# EAGLE design ReflowMaster (EAGLE 7.1.0)
COMPANY: Unexpected Maker; COPYRIGHT: 2018; DATE: 2018; DRAWN: SEON; REV: F; TITLE: Time Timer Controller Board
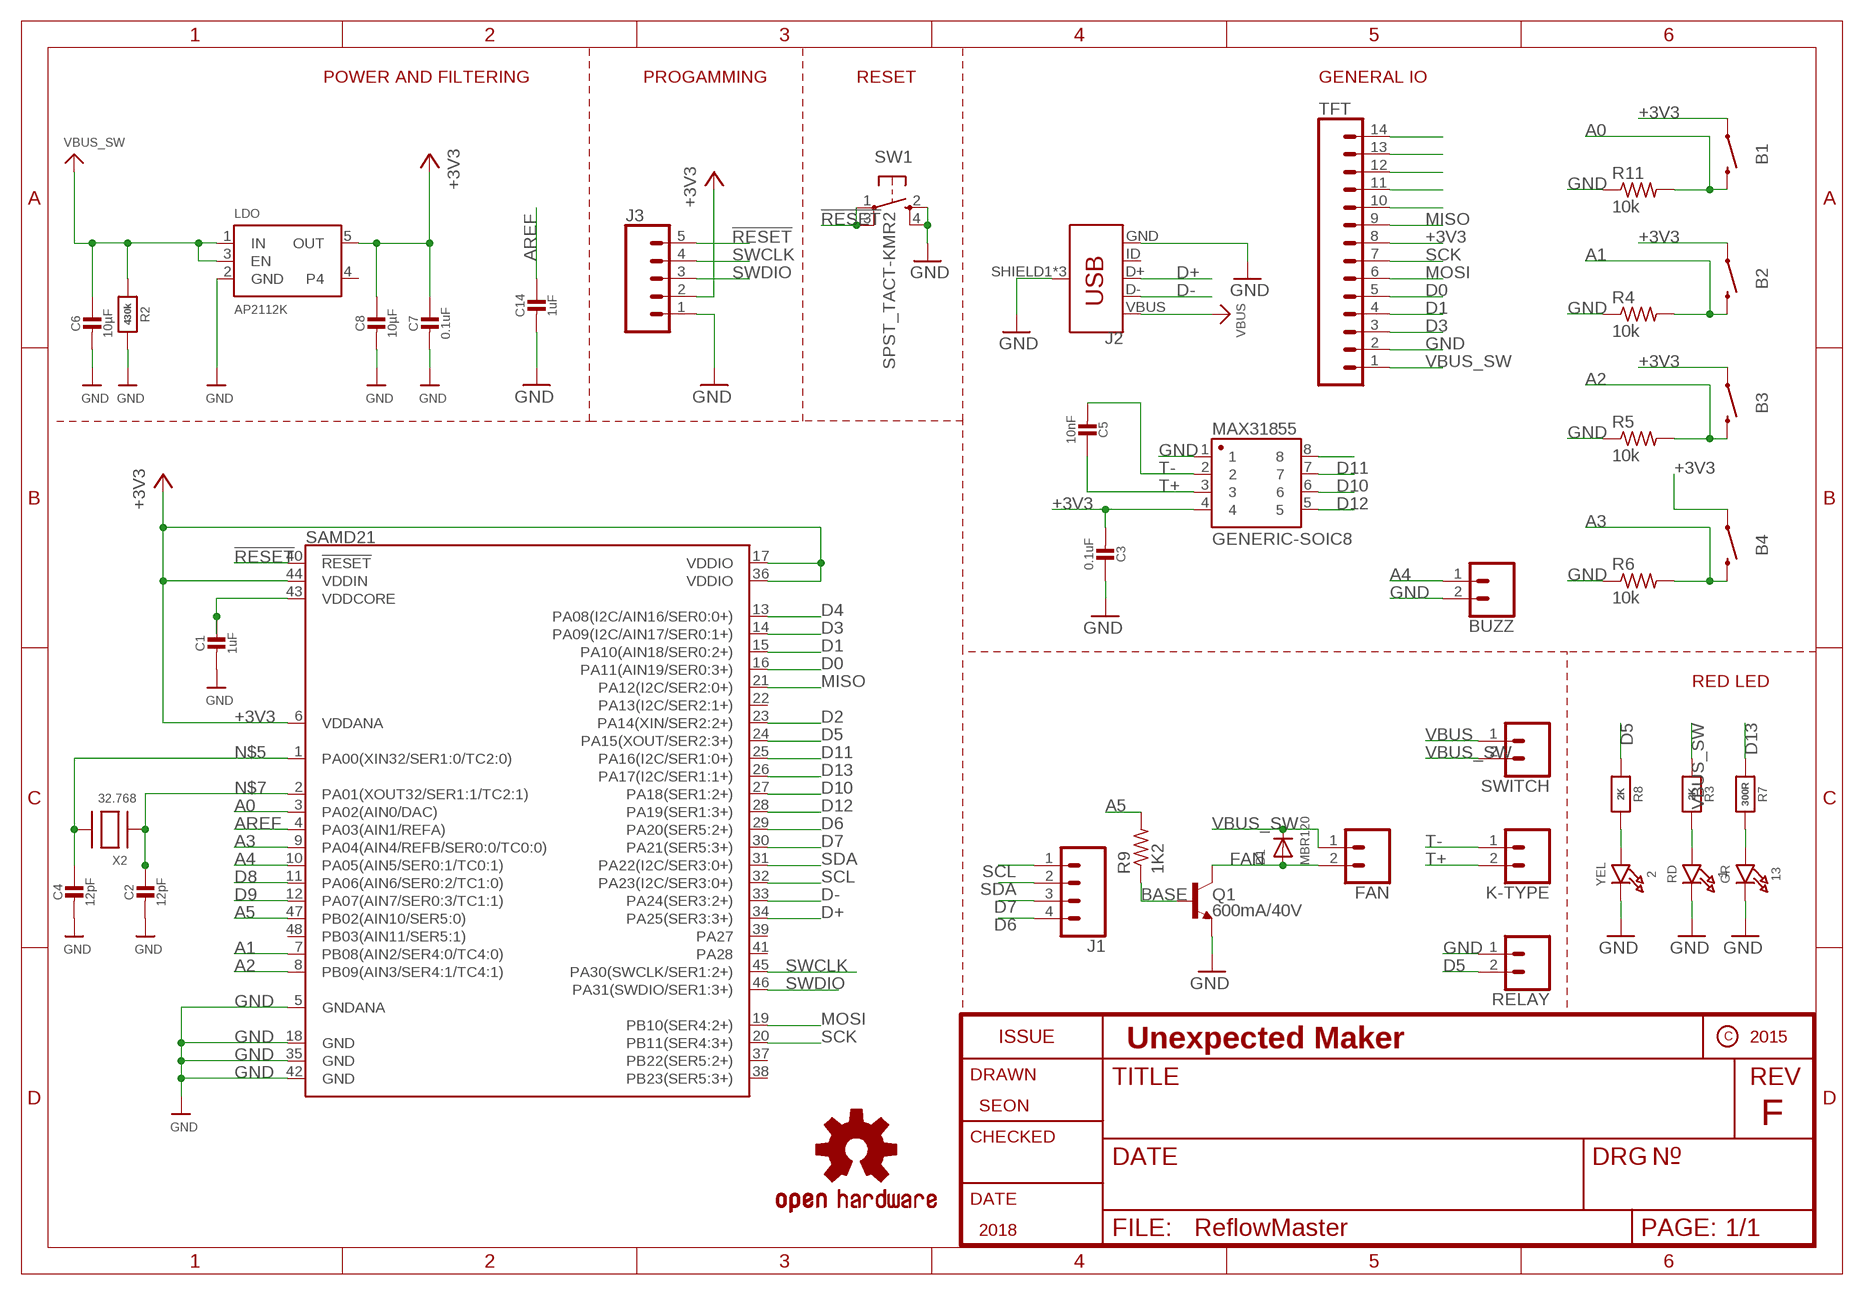
[diagram p0: schematic, sheet 1]

## Parts
1  RD  LED0805_NOOUTLINE  [CHIPLED_0805_NOOUTLINE]
2  YEL  LED0805_NOOUTLINE  [CHIPLED_0805_NOOUTLINE]
13  GR  LED0805_NOOUTLINE  [CHIPLED_0805_NOOUTLINE]
B1  MOMENTARY-SWITCH-SPST-PTH-RIGHT-ANGLE-KIT  [TACTILE_SWITCH_PTH_RIGHT_ANGLE_KIT]
B2  MOMENTARY-SWITCH-SPST-PTH-RIGHT-ANGLE-KIT  [TACTILE_SWITCH_PTH_RIGHT_ANGLE_KIT]
B3  MOMENTARY-SWITCH-SPST-PTH-RIGHT-ANGLE-KIT  [TACTILE_SWITCH_PTH_RIGHT_ANGLE_KIT]
B4  MOMENTARY-SWITCH-SPST-PTH-RIGHT-ANGLE-KIT  [TACTILE_SWITCH_PTH_RIGHT_ANGLE_KIT]
BUZZ  CONN_02  [1X02]
C1  1uF  CAP_CERAMIC0805-NOOUTLINE  [0805-NO]
C2  12pF  CAP_CERAMIC0805-NOOUTLINE  [0805-NO]
C3  0.1uF  CAP_CERAMIC0805-NOOUTLINE  [0805-NO]
C4  12pF  CAP_CERAMIC0805-NOOUTLINE  [0805-NO]
C5  10nF  CAP_CERAMIC0805-NOOUTLINE  [0805-NO]
C6  10µF  CAP_CERAMIC0805-NOOUTLINE  [0805-NO]
C7  0.1uF  CAP_CERAMIC0805-NOOUTLINE  [0805-NO]
C8  10µF  CAP_CERAMIC0805-NOOUTLINE  [0805-NO]
C14  1uF  CAP_CERAMIC0805-NOOUTLINE  [0805-NO]
D1  MBR120  DIODESOD-123  [SOD-123]
FAN  CONN_02  [1X02]
J1  CONN_041X04_NO_SILK  [1X04_NO_SILK]
J2  USB_MICRO-B_FEMALE-SMT  [USB-B-MICRO-SMD]
J3  CONN_05NO_SILK  [1X05_NO_SILK]
K-TYPE  CONN_02  [1X02]
LDO  AP2112K  VREG_SOT23-5  [SOT23-5]
LOGO1  OSHW-LOGOS  [OSHW-LOGO-S]
MAX31855  GENERIC-SOIC8  [SO08-UNIVERSAL]
Q1  600mA/40V  TRANS_NPN-MMBT2222AL  [SOT23-3]
R2  430k  RESISTOR0805_NOOUTLINE  [0805-NO]
R3  2K  RESISTOR0805_NOOUTLINE  [0805-NO]
R4  10k  R-US_R0805  [R0805]
R5  10k  R-US_R0805  [R0805]
R6  10k  R-US_R0805  [R0805]
R7  300R  RESISTOR0805_NOOUTLINE  [0805-NO]
R8  2K  RESISTOR0805_NOOUTLINE  [0805-NO]
R9  1K2  R-US_R0805  [R0805]
R11  10k  R-US_R0805  [R0805]
RELAY  CONN_02  [1X02]
SAMD21  ATSAMD21G-A  [TQFP-48]
SW1  SPST_TACT-KMR2  [KMR2]
SWITCH  CONN_02  [1X02]
TFT  CONN_14NO_SILK  [1X14_NO_SILK]
X2  32.768  XTAL-3.2X1.5  [XTAL3215]

## Nets
!RESET: J3.5 SAMD21.40(!RESET!) SW1.1(P) SW1.3(P1)
+3V3: B1.1 B2.1 B3.1 B4.1 C3.2 C7.1 C8.1 J3.2 LDO.5(OUT) MAX31855.4 SAMD21.6(VDDANA) SAMD21.17(VDDIO) SAMD21.36(VDDIO) SAMD21.44(VDDIN) TFT.8
A0: B1.2 R11.2 SAMD21.3(PA02(AIN0/DAC))
A1: B2.2 R4.2 SAMD21.7(PB08(AIN2/SER4:0/TC4:0))
A2: B3.2 R5.2 SAMD21.8(PB09(AIN3/SER4:1/TC4:1))
A3: B4.2 R6.2 SAMD21.9(PA04(AIN4/REFB/SER0:0/TC0:0))
A4: BUZZ.1 SAMD21.10(PA05(AIN5/SER0:1/TC0:1))
A5: R9.2 SAMD21.47(PB02(AIN10/SER5:0))
AREF: C14.1 SAMD21.4(PA03(AIN1/REFA))
BASE: Q1.1(B) R9.1
D0: SAMD21.16(PA11(AIN19/SER0:3+)) TFT.5
D1: SAMD21.15(PA10(AIN18/SER0:2+)) TFT.4
D2: SAMD21.23(PA14(XIN/SER2:2+))
D3: SAMD21.14(PA09(I2C/AIN17/SER0:1+)) TFT.3
D4: SAMD21.13(PA08(I2C/AIN16/SER0:0+))
D5: R8.1 RELAY.2 SAMD21.24(PA15(XOUT/SER2:3+))
D6: J1.4 SAMD21.29(PA20(SER5:2+))
D7: J1.3 SAMD21.30(PA21(SER5:3+))
D8: SAMD21.11(PA06(AIN6/SER0:2/TC1:0))
D9: SAMD21.12(PA07(AIN7/SER0:3/TC1:1))
D10: MAX31855.6 SAMD21.27(PA18(SER1:2+))
D11: MAX31855.7 SAMD21.25(PA16(I2C/SER1:0+))
D12: MAX31855.5 SAMD21.28(PA19(SER1:3+))
D13: R7.1 SAMD21.26(PA17(I2C/SER1:1+))
D+: J2.D+ SAMD21.34(PA25(SER3:3+))
D-: J2.D- SAMD21.33(PA24(SER3:2+))
FAN: D1.A FAN.2 Q1.3(C)
GND: 1.C 2.C 13.C BUZZ.2 C1.2 C2.2 C3.1 C4.2 C6.2 C7.2 C8.2 C14.2 J2.GND J2.SHIELD1(SHIELD) J2.SHIELD2(SHIELD) J2.SHIELD3(SHIELD) J3.1 LDO.2(GND) MAX31855.1 Q1.2(E) R2.2 R4.1 R5.1 R6.1 R11.1 RELAY.1 SAMD21.5(GNDANA) SAMD21.18(GND) SAMD21.35(GND) SAMD21.42(GND) SW1.2(S) SW1.4(S1) TFT.2
MISO: SAMD21.21(PA12(I2C/SER2:0+)) TFT.9
MOSI: SAMD21.19(PB10(SER4:2+)) TFT.6
N$1: 1.A R3.2
N$2: 13.A R7.2
N$3: 2.A R8.2
N$5: C4.1 SAMD21.1(PA00(XIN32/SER1:0/TC2:0)) X2.P$2
N$7: C2.1 SAMD21.2(PA01(XOUT32/SER1:1/TC2:1)) X2.P$1
N$8: MAX31855.8
N$11: TFT.10
N$12: TFT.11
N$13: TFT.12
N$14: TFT.13
N$15: TFT.14
SCK: SAMD21.20(PB11(SER4:3+)) TFT.7
SCL: J1.1 SAMD21.32(PA23(I2C/SER3:0+))
SDA: J1.2 SAMD21.31(PA22(I2C/SER3:0+))
SWCLK: J3.4 SAMD21.45(PA30(SWCLK/SER1:2+))
SWDIO: J3.3 SAMD21.46(PA31(SWDIO/SER1:3+))
T+: C5.1 K-TYPE.2 MAX31855.3
T-: C5.2 K-TYPE.1 MAX31855.2
VBUS: J2.VBUS SWITCH.1
VBUS_SW: C6.1 D1.C FAN.1 LDO.1(IN) LDO.3(EN) R2.1 R3.1 SWITCH.2 TFT.1
VDDCORE: C1.1 SAMD21.43(VDDCORE)
Unconnected: J2.ID LDO.4 SAMD21.22(PA13(I2C/SER2:1+)) SAMD21.37(PB22(SER5:2+)) SAMD21.38(PB23(SER5:3+)) SAMD21.39(PA27) SAMD21.41(PA28) SAMD21.48(PB03(AIN11/SER5:1))

## Notes on the sheet
- POWER AND FILTERING | PROGAMMING | RESET | GENERAL IO
- RED LED

## Library data of the parts
1 2 13 = microbuilder:LED: LED 0603 - 0603 Surface Mount Package 2mA: Green LED - Low Power (3.9mcd, 2ma, 1.7Vf) - Digikey: 475-2709-2-ND Orange LED - Low Power (9.8mcd, 2ma, 1.8Vf) - Digikey: 475-1194-2-ND Red LED - Low Power (5mcd, 2ma, 1.8Vf) - Digikey: 475-1195-2-ND Yellow LED - Low Power (7mcd, 2ma, 1.8Vf) - Digikey: 475-1196-2-ND 5mA: Blue LED - Low Power (17mcd, 5ma, 2.9Vf) - Digikey: LNJ937W8CRACT-ND 0805 - 0805 Surface Mount Package 2mA: Red LED (8.8mcd, 2mA, 1.8Vf, Clear) - Low Power [Digikey: 475-2510-1-ND] Green LED (5mcd, 2mA, 1.8Vf, Clear) - Low Power [Digikey: 475-2730-1-ND] Yellow LED (11.3mcd, 2mA, 1.8Vf, Clear) - Low Power [Digikey: 475-2555-1-ND] 20mA: Red LED (104mcd, 20mA, Diffused) - LS R976 [Digikey: 475-1278-6-ND] Red LED (12mcd, 20mA, 2.0Vf, Clear) - APT2012EC [Digikey: 754-1128-1-ND] Green LED (15mcd, 20mA, 2.2Vf, Clear) - APT2012GC [Digikey: 754-1131-1-ND] Orange LED (160mcd, 20mA, 2.1Vf, Clear) - APT2012SECK [Digikey: 754-1130-1-ND] 1206 - 1206 Surface Mount Package Green LED (26mcd, 20mA, Diffused) - LG N971 [Digikey: 475-1407-6-ND] Red LED (15mcd, 20mA, Diffused) - LH N974 [Digikey: 475-1416-6-ND] Cree - Cree High-Power Surface Mount LEDs XPEBWT-L1-0000-00D50 - White 111lm 350mA 2.9Vf 6200K 110° XTEAWT-00-0000-00000LEE3 - White 114lm 350mA 2.85Vf 5000K 115° Everlight - Everlight 45-21 Series Surface Mount LEDs 45-21/QK2C-B2832AC2CB2/2T - Warm White 2000mcd 20mA 3.25Vf 3050K 120° 45-21/LK2C-B38452C4CB2/2T - Nuetral White 2000mcd 20mA 3.25Vf 4150K 120° 45-21/LK2C-B50634C6CB2/2T - Cold White 2200mcd 20mA 3.25Vf 5650K 120° PLCC2 Reverse Mount LS T77K-J1L2-1-0-2-R18-Z - Red 11.25mcd 2mA 1.8Vf 630nm 120° LO T77K-L1M2-24-Z - Orange 19.6mcd 2mA 1.8Vf 606nm 120° LY T77K-K2M1-26-Z - Yellow 15.7mcd 2mA 1.8Vf 587nm 120°
B1-B4 = SparkFun-Switches:MOMENTARY-SWITCH-SPST: Momentary Switch (Pushbutton) - SPST Normally-open (NO) SPST momentary switches (buttons, pushbuttons). Variants PTH-12MM - 12mm square, through-hole Momentary Pushbutton Switch - 12mm Square <https://www.sparkfun.com/products/9190> (COM-09190) PTH-6.0MM, PTH-6.0MM-KIT - 6.0mm square, through-hole Mini Pushbutton Switch <https://www.sparkfun.com/products/97> (COM-00097) KIT package intended for soldering kit's - only one side of pads' copper is exposed. PTH-RIGHT-ANGLE-KIT - Right-angle, through-hole Right Angle Tactile Button <https://www.sparkfun.com/products/10791> - Used on SparkFun BigTime Watch Kit <https://www.sparkfun.com/products/11734> SMD-12MM - 12mm square, surface-mount Tactile Button - SMD (12mm) <https://www.sparkfun.com/products/12993> (COM-12993) Used on SparkFun PicoBoard <https://www.sparkfun.com/products/11888> SMD-4.5MM - 4.5mm Square Trackball Switch Used on SparkFun Blackberry Trackballer Breakout <https://www.sparkfun.com/products/13169> SMD-4.6MMX2.8MM - 4.60mm x 2.80mm, surface mount Used on SparkFun SAMD21 Mini Breakout <https://www.sparkfun.com/products/13664> SMD-5.2MM, SMD-5.2-REDUNDANT - 5.2mm square, surface-mount Mini Pushbutton Switch - SMD <https://www.sparkfun.com/products/8720> (COM-08720) Used on Arduino Pro Mini <https://www.sparkfun.com/products/11114> REDUNDANT package connects both switch circuits together SMD-6.0X3.5MM - 6.0 x 3.5mm, surface mount Momentary Reset Switch SMD <https://www.sparkfun.com/products/8229> (COM-08229) SMD-6.2MM-TALL - 6.2mm square, surface mount Tactile Button - SMD (6mm) <https://www.sparkfun.com/products/12992> Used on SparkFun Digital Sandbox <https://www.sparkfun.com/products/12651> SMD-RIGHT-ANGLE - Right-angle, surface mount Used on SparkFun Block for Intel® Edison - Arduino <https://www.sparkfun.com/products/13036>; PROD_ID: CONN-10672; SF_SKU: COM-10791
BUZZ FAN K-TYPE RELAY SWITCH = SparkFun-Connectors:CONN_02: Multi connection point. Often used as Generic Header-pin footprint for 0.1 inch spaced/style header connections On any of the 0.1 inch spaced packages, you can populate with these: Break Away Headers - Straight <https://www.sparkfun.com/products/116> (PRT-00116) Break Away Male Headers - Right Angle <https://www.sparkfun.com/products/553> (PRT-00553) Female Headers <https://www.sparkfun.com/products/115> (PRT-00115) Break Away Headers - Machine Pin <https://www.sparkfun.com/products/117> (PRT-00117) Break Away Female Headers - Swiss Machine Pin <https://www.sparkfun.com/products/743> (PRT-00743) For SCREWTERMINALS and SPRING TERMINALS visit here: Screw Terimnals on SparkFun.com <https://www.sparkfun.com/search/results?term=Screw+Terminals> (5mm/3.5mm/2.54mm spacing) This device is also useful as a general connection point to wire up your design to another part of your project. Our various solder wires solder well into these plated through hole pads. Hook-Up Wire - Assortment (Stranded, 22 AWG) <https://www.sparkfun.com/products/11375> (PRT-11375) Hook-Up Wire - Assortment (Solid Core, 22 AWG) <https://www.sparkfun.com/products/11367> (PRT-11367) View the entire wire category on our website here <https://www.sparkfun.com/categories/141> Special notes: Molex polarized connector foot print use with: PRT-08233 with associated crimp pins and housings. 2.54_SCREWTERM for use with PRT-10571. 3.5mm Screw Terminal footprints for PRT-08084 5mm Screw Terminal footprints for use with PRT-08432
C1-C8 C14 = microbuilder:CAP_CERAMIC: Ceramic Capacitors For new designs, use the packages preceded by an '_' character since they are more reliable: The following footprints should be used on most boards: _0402 - Standard footprint for regular board layouts _0603 - Standard footprint for regular board layouts _0805 - Standard footprint for regular board layouts _1206 - Standard footprint for regular board layouts For extremely tight-pitch boards where space is at a premium, the following 'micro-pitch' footprints can be used (smaller pads, no silkscreen outline, etc.): _0402MP - Micro-pitch footprint for very dense/compact boards _0603MP - Micro-pitch footprint for very dense/compact boards _0805MP - Micro-pitch footprint for very dense/compact boards _1206MP - Micro-pitch footprint for very dense/compact boards
D1 = microbuilder:DIODE: Diode SMA Model Volts Amps Type Vf Vr Digikey # Notes SSA34-E3 40V 3A Schottky 480mV @ 3A 200uA @ 40V SSA34-E3/61TGITR-ND CDBA120-G 20V 1A Schottky 500mV @ 1A 500uA @ 20V 641-1014-6-ND REEL MBRA210 10V 2A Schottky 350mV @ 2A 700uA @ 10V MBRA210LT3 SOD-123 Model Volts Amps Type Vf Vr Order # Notes BAT54T1G 30V 200mA Schottky 800mV @ 200mA 2uA @ 25V BAT54T1GOSTR-ND B0530W 30V 500mA Schottky 430mV @ 500mA 130uA @ 30V B0530W-FDICT-ND REEL MBR120 1A 20V Schottky 340mV @ 1A MBR120VLSFT1GOSCT-ND SOD-323 Model Volts Amps Type Vf Vr Order # Notes PMEG2005EJ 20V 500mA Schottky 355mV @ 500mA 568-4110-1-ND ZLLS410 10V 570mA Schottky 380mV @ 570mA ZLLS410CT-ND 1N4148WS 75V 150mA Silicon/Simple 1V 1N4148WSFSCT-ND REEL SOD-523 Model Volts Amps Type Vf Vr Order # Notes BAT54XV2 30V 200mA Schottky 0.8V @ 100mA BAT54XV2CT-ND TB751S 30V 30mA Schottky RB751S-40TE61CT-ND SOT23-R/W (R = Solder Paste/Reflow Ovens, W = Hand-Soldering) Model Volts Amps Type Vf Vr Order # Notes BAT54FILM 40V 300mA Schottky 497-7162-1-ND
J1 = SparkFun-Connectors:CONN_04: Multi connection point. Often used as Generic Header-pin footprint for 0.1 inch spaced/style header connections On any of the 0.1 inch spaced packages, you can populate with these: Break Away Headers - Straight <https://www.sparkfun.com/products/116> (PRT-00116) Break Away Male Headers - Right Angle <https://www.sparkfun.com/products/553> (PRT-00553) Female Headers <https://www.sparkfun.com/products/115> (PRT-00115) Break Away Headers - Machine Pin <https://www.sparkfun.com/products/117> (PRT-00117) Break Away Female Headers - Swiss Machine Pin <https://www.sparkfun.com/products/743> (PRT-00743) For SCREWTERMINALS and SPRING TERMINALS visit here: Screw Terimnals on SparkFun.com <https://www.sparkfun.com/search/results?term=Screw+Terminals> (5mm/3.5mm/2.54mm spacing) This device is also useful as a general connection point to wire up your design to another part of your project. Our various solder wires solder well into these plated through hole pads. Hook-Up Wire - Assortment (Stranded, 22 AWG) <https://www.sparkfun.com/products/11375> (PRT-11375) Hook-Up Wire - Assortment (Solid Core, 22 AWG) <https://www.sparkfun.com/products/11367> (PRT-11367) View the entire wire category on our website here <https://www.sparkfun.com/categories/141> Special notes: Molex polarized connector foot print use with SKU : PRT-08231 with associated crimp pins and housings. 1MM SMD Version SKU: PRT-10208; PROD_ID: CONN-09696
J2 = SparkFun-Connectors:USB_MICRO-B: USB Type Micro-B Connector Male/female and PTH/SMT variants SparkFun Products: SparkFun microB USB Breakout <https://www.sparkfun.com/products/12035> SparkFun USB microB Plug Breakout <https://www.sparkfun.com/products/10031> SparkFun ESP8266 Thing <https://www.sparkfun.com/products/13231>; PROD_ID: CONN-11752
J3 = SparkFun-Connectors:CONN_05: Multi connection point. Often used as Generic Header-pin footprint for 0.1 inch spaced/style header connections On any of the 0.1 inch spaced packages, you can populate with these: Break Away Headers - Straight <https://www.sparkfun.com/products/116> (PRT-00116) Break Away Male Headers - Right Angle <https://www.sparkfun.com/products/553> (PRT-00553) Female Headers <https://www.sparkfun.com/products/115> (PRT-00115) Break Away Headers - Machine Pin <https://www.sparkfun.com/products/117> (PRT-00117) Break Away Female Headers - Swiss Machine Pin <https://www.sparkfun.com/products/743> (PRT-00743) For SCREWTERMINALS and SPRING TERMINALS visit here: Screw Terimnals on SparkFun.com <https://www.sparkfun.com/search/results?term=Screw+Terminals> (5mm/3.5mm/2.54mm spacing) This device is also useful as a general connection point to wire up your design to another part of your project. Our various solder wires solder well into these plated through hole pads. Hook-Up Wire - Assortment (Stranded, 22 AWG) <https://www.sparkfun.com/products/11375> (PRT-11375) Hook-Up Wire - Assortment (Solid Core, 22 AWG) <https://www.sparkfun.com/products/11367> (PRT-11367) View the entire wire category on our website here <https://www.sparkfun.com/categories/141> Special notes: Molex polarized connector foot print use with SKU : PRT-08231 with associated crimp pins and housings. 1MM SMD Version SKU: PRT-10208
LDO = microbuilder:VREG_SOT23-5: SOT23-5 Fixed Voltage Regulators Part Current Out V Out V In V Dropout θJA (°C/W) TJ (°C) Digikey Part No. ADP121 150mA 3.3V 3.4-5.5V 0.09V @ 150mA -- -- ADP121-AUJZ33R7CT-ND ADP121 150mA 3.0V 3.1-5.5V 0.09V @ 150mA -- -- ADP121-AUJZ30R7CT-ND ADP122 300mA 3.3V 3.4-5.5V 0.085V @ 300mA -- -- ADP122AUJZ-3.3-R7CT-ND ADP1712 300mA 3.3V 3.5-5.5V 0.17V @ 300mA -- -- ADP1712AUJZ-3.3-R7TR-ND AP7311 (Low Cost) 150mA 3.3V 3.5-6V 0.15V @ 150mA -- -- AP7311-33WG-7DICT-ND LD39015M18R 150mA 1.8V 1.9V-5.5V 0.08V @ 100mA -- -- 497-6977-1-ND LP2985A-33DBVR 150mA 3.3V 3.3-16V 0.28V @ 150mA 206 150 296-18479-1-ND MCP1824T-3302E/OT 300mA 3.3V 3.5V-6V 0.2V @ 300mA -- -- MCP1824T-3302E/OTCT-ND MIC5205-2.5YM5 TR 150mA 2.5V 2.7-16V 0.165V @ 150mA -- -- 576-1257-2-ND MIC5205-3.0YM5 TR 150mA 3.0V 3.2V-16V 0.165V @ 150mA -- -- 576-1258-2-ND MIC5205-3.3YM5 TR 150mA 3.3V 3.5V-16V 0.165V @ 150mA -- -- 576-1259-2-ND TPS780330220 150mA 3.3V+2.2V 3.6-5.5V 250mV Max -- -- 296-23332-1-ND TDA3663/N1,135 100mA 3.3V 3.5-45V 0.18V @ 50mA -- -- 568-5343-1-ND Max operating temp can be calculated using θJA, TJ (max junction temperature), and power in watts. Set the "Maximum Ambient Temperature" until it reaches TJ ("Max Junction Temperature"), which is the absolute limit for safe use of the regulator: Heat Sink Temperature Calculator <http://www.daycounter.com/Calculators/Heat-Sink-Temperature-Calculator.phtml> For example, With 12V source into a 3.3V LP2985 and a 30mA load, we are dissipating (12V-3.3V) * 0.03A = 0.261W. With a θJA of 206 °C/W, a TJ of 150°C, and 261mW we can safely use the chip without a heat sink up to 75°C (=147.1°C Junction Temperature).
LOGO1 = SparkFun-Aesthetics:OSHW-LOGO: Open-Source Hardware (OSHW) Logo This logo indicates the piece of hardware it is found on incorporates a OSHW license and/or adheres to the definition of open source hardware found here: http://freedomdefined.org/OSHW
MAX31855 = SparkFun-Retired:GENERIC-SOIC8: A placeholder for generic narrow & wide SOIC8 foorptints - used on the DIP adapter board. Has strange reference to IC-10141, a Seven Band Graphic Equalizer Display Filter SOIC-8 VFP: IC-10141
Q1 = SparkFun-DiscreteSemi:TRANS_NPN: NPN transistor Current controlled devices typically used to amplify current or used as a switch. BC547 - COM-08928 <http://www.sparkfun.com/products/8928> (TO-92 45V 100mA) (1.Collector 2.Base 3.Emitter) 2N3904 - COM-00521 <http://www.sparkfun.com/products/521> (TO-92 40V 200mA) (1.Emitter 2.Base 3.Collector) P2N2222A - COM-12852 <http://www.sparkfun.com/products/12852> (TO-92 40V 600mA) (1.Collector 2.Base 3.Emitter); PROD_ID: TRANS-08049
R2 R3 R7 R8 = microbuilder:RESISTOR: Resistors For new designs, use the packages preceded by an '_' character since they are more reliable: The following footprints should be used on most boards: _0402 - Standard footprint for regular board layouts _0603 - Standard footprint for regular board layouts _0805 - Standard footprint for regular board layouts _1206 - Standard footprint for regular board layouts For extremely tight-pitch boards where space is at a premium, the following 'micro-pitch' footprints can be used (smaller pads, no silkscreen outline, etc.): _0402MP - Micro-pitch footprint for very dense/compact boards _0603MP - Micro-pitch footprint for very dense/compact boards _0805MP - Micro-pitch footprint for very dense/compact boards _1206MP - Micro-pitch footprint for very dense/compact boards
R4-R6 R9 R11 = rcl:R-US_: RESISTOR, American symbol
SAMD21 = SparkFun-IC-Microcontroller:ATSAMD21G: Atmel SAMD21G SMART ARM-Based Microcontroller The Atmel ® | SMART ™ SAM D21 is a series of low-power microcontrollers using the 32-bit ARM ® Cortex ® -M0+ processor, and ranging from 32- to 64-pins with up to 256KB Flash and 32KB of SRAM. The SAM D21 devices operate at a maximum frequency of 48MHz and reach 2.46 CoreMark/MHz. They are designed for simple and intuitive migration with identical peripheral modules, hex compatible code, identical linear address map and pin compatible migration paths between all devices in the product series. All devices include intelligent and flexible peripherals, Atmel Event System for inter-peripheral signaling, and support for capacitive touch button, slider and wheel user interfaces. Datasheet <https://cdn.sparkfun.com/datasheets/Dev/Arduino/Boards/Atmel-42181-SAM-D21_Datasheet.pdf> SparkFun Products SparkFun SAMD21 Mini Breakout <https://www.sparkfun.com/products/13664> (DEV-13664) SparkFun SAMD21 Dev Breakout <https://www.sparkfun.com/products/13672> (DEV-13672); PROD_ID: IC-13064
SW1 = adafruit:SPST_TACT: SMT 6mm switch, EVQQ2 series http://www.ladyada.net/library/eagle
TFT = SparkFun-Connectors:CONN_14: Multi connection point. Often used as Generic Header-pin footprint for 0.1 inch spaced/style header connections On any of the 0.1 inch spaced packages, you can populate with these: Break Away Headers - Straight <https://www.sparkfun.com/products/116> (PRT-00116) Break Away Male Headers - Right Angle <https://www.sparkfun.com/products/553> (PRT-00553) Female Headers <https://www.sparkfun.com/products/115> (PRT-00115) Break Away Headers - Machine Pin <https://www.sparkfun.com/products/117> (PRT-00117) Break Away Female Headers - Swiss Machine Pin <https://www.sparkfun.com/products/743> (PRT-00743) For SCREWTERMINALS and SPRING TERMINALS visit here: Screw Terimnals on SparkFun.com <https://www.sparkfun.com/search/results?term=Screw+Terminals> (5mm/3.5mm/2.54mm spacing) This device is also useful as a general connection point to wire up your design to another part of your project. Our various solder wires solder well into these plated through hole pads. Hook-Up Wire - Assortment (Stranded, 22 AWG) <https://www.sparkfun.com/products/11375> (PRT-11375) Hook-Up Wire - Assortment (Solid Core, 22 AWG) <https://www.sparkfun.com/products/11367> (PRT-11367) View the entire wire category on our website here <https://www.sparkfun.com/categories/141> Special notes: Molex polarized connector foot print use with SKU : PRT-08231 with associated crimp pins and housings. 1MM SMD Version SKU: PRT-10208 NOTES ON THE VARIANTS LOCK and LOCK_LONGPADS... This footprint was designed to help hold the alignment of a through-hole component (i.e. 6-pin header) while soldering it into place. You may notice that each hole has been shifted either up or down by 0.005 of an inch from it's more standard position (which is a perfectly straight line). This slight alteration caused the pins (the squares in the middle) to touch the edges of the holes. Because they are alternating, it causes a "brace" to hold the component in place. 0.005 has proven to be the perfect amount of "off-center" position when using our standard breakaway headers. Although looks a little odd when you look at the bare footprint, once you have a header in there, the alteration is very hard to notice. Also,if you push a header all the way into place, it is covered up entirely on the bottom side.
X2 = adafruit2:XTAL: Low cost SMT crystals, no capacitors included http://www.ladyada.net/library/eagle

## Net classes
0 default: width 0.203 mm, drill 0.406 mm, clearance 0.203 mm

## Board
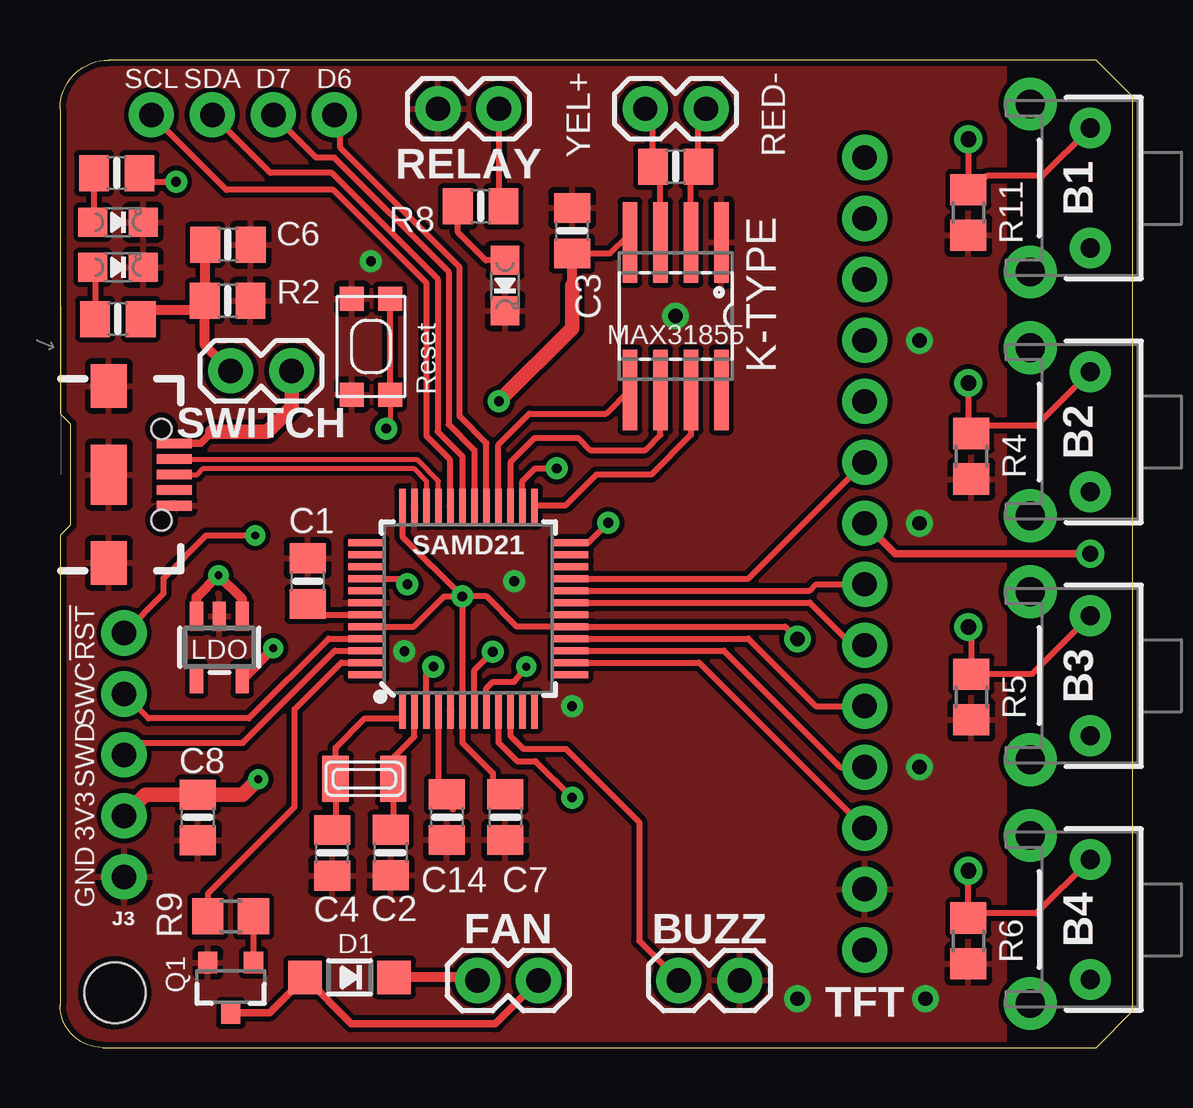
[diagram p1: board, top side]
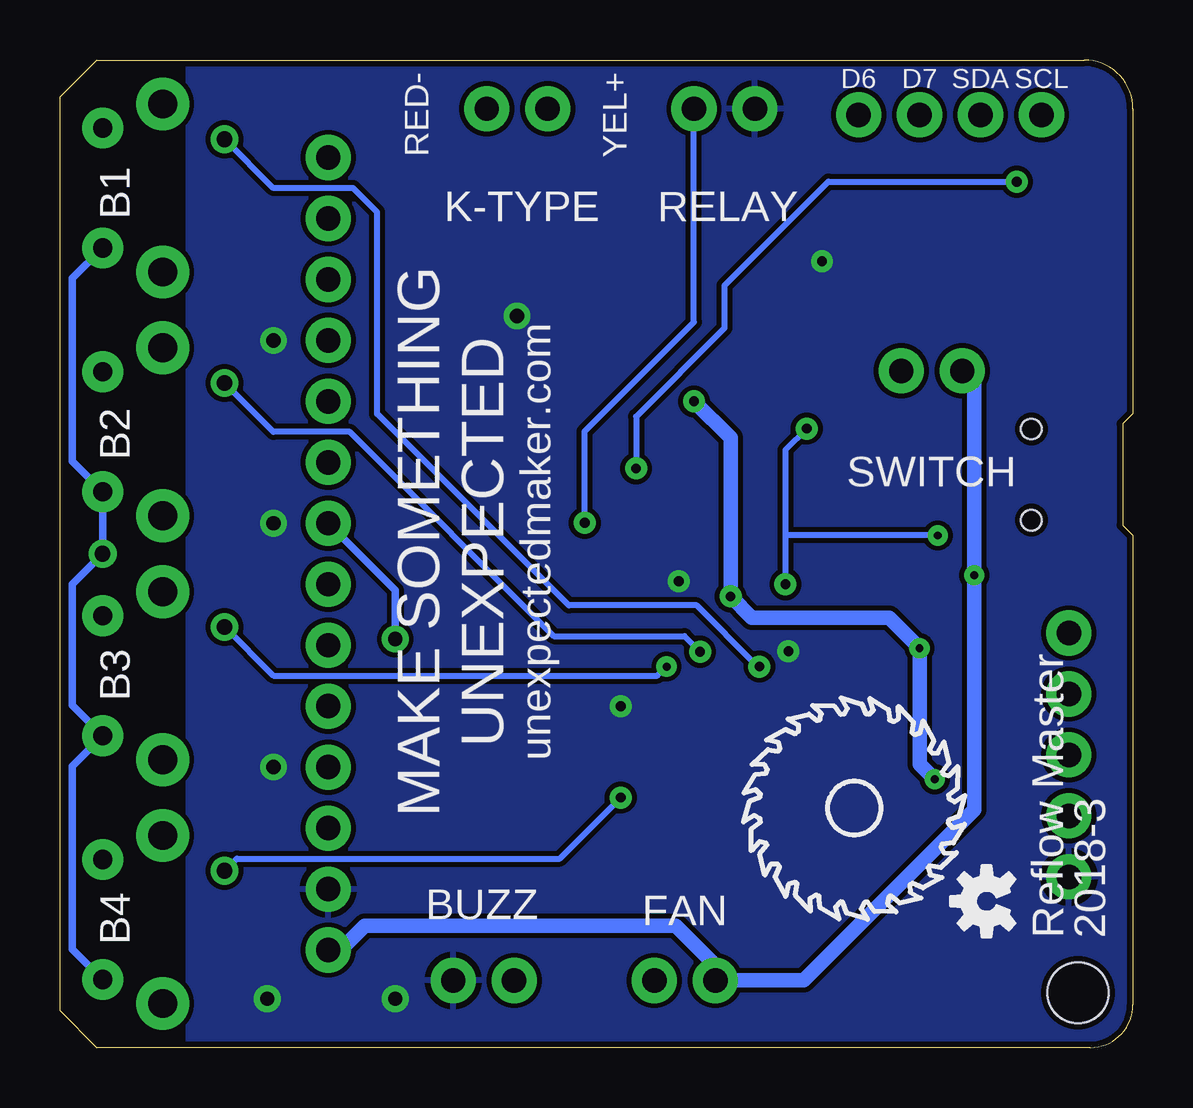
[diagram p2: board, bottom side, seen from below]

Size 44.7 x 41.15 mm. Coordinates in mm from the lower left corner, seen from the top.
Outline: 0,39.12 0,26.42 0.43,25.98 0.43,21.77 0,21.34 0,1.78 arc90 1.78,0 43.18,0 44.7,1.52 44.7,39.62 43.18,41.15 2.03,41.15 arc90 0,39.12
Copper layers (1*16): Top 0.035mm / dielectric 1.5mm / Bottom 0.035mm
Design rules "SparkFun *": minimum track width 8mil, minimum drill 14mil, track to track 6mil, track to pad 6mil, pad to pad 6mil, via to via 6mil, smd to smd 6mil, copper to edge 10mil, drill to drill 8mil, minimum pad ring 12mil, minimum via ring 10mil, stop-mask expansion 4mil, vias tented up to drill 25mil, thermal gap 10mil
Holes 2.54 mm at 2.29,2.29

### Footprints (pad centres in the part's own frame; a part is rotated, then mirrored left to right if it is on the bottom)
CHIPLED_0805_NOOUTLINE = smd 1.2 x 1.2: A 0,-1.05; C 0,1.05
TACTILE_SWITCH_PTH_RIGHT_ANGLE_KIT = drill 0.8 pad 1.7: 1 -2.5,0; 2 2.5,0 | drill 1.2 pad 2.2: ANCHOR1 -3.5,2.5; ANCHOR2 3.5,2.5
1X02 = drill 1.016 pad 1.88: 1 0,0; 2 2.54,0
0805-NO = smd 1.24 x 1.5: 1 -0.95,0; 2 0.95,0
SOD-123 = smd 1.4 x 1.4: A 1.85,0; C -1.85,0
1X04_NO_SILK = drill 1.016 pad 1.88: 1 0,0; 2 2.54,0; 3 5.08,0; 4 7.62,0
USB-B-MICRO-SMD = smd 1.45 x 0.4: D+ 2.725,0; D- 2.725,0.65; GND 2.725,-1.3; ID 2.725,-0.65; VBUS 2.725,1.3 | smd 1.5 x 1.8: SHIELD1 0,3.685; SHIELD2 0,-3.685 | smd 1.5 x 2.5: SHIELD3 0,0 | hole 0.85: 2.2,1.9; 2.2,-1.9
1X05_NO_SILK = drill 1.016 pad 1.88: 1 0,0; 2 2.54,0; 3 5.08,0; 4 7.62,0; 5 10.16,0
SOT23-5 = smd 0.55 x 1.2: 1 -0.95,-1.3; 2 0,-1.3; 3 0.95,-1.3; 4 0.95,1.3; 5 -0.95,1.3
SO08-UNIVERSAL = smd 0.61 x 3.353: 1 -1.905,-3.073; 2 -0.635,-3.073; 3 0.635,-3.073; 4 1.905,-3.073; 5 1.905,3.073; 6 0.635,3.073; 7 -0.635,3.073; 8 -1.905,3.073
SOT23-3 = smd 0.8 x 0.9: 1 -0.95,-1; 2 0.95,-1; 3 0,1.1
R0805 = smd 1.3 x 1.5: 1 -0.95,0; 2 0.95,0
TQFP-48 = smd 1.5 x 0.28: 1 -4.25,2.75; 2 -4.25,2.25; 3 -4.25,1.75; 4 -4.25,1.25; 5 -4.25,0.75; 6 -4.25,0.25; 7 -4.25,-0.25; 8 -4.25,-0.75; 9 -4.25,-1.25; 10 -4.25,-1.75; 11 -4.25,-2.25; 12 -4.25,-2.75; 25 4.25,-2.75; 26 4.25,-2.25; 27 4.25,-1.75; 28 4.25,-1.25; 29 4.25,-0.75; 30 4.25,-0.25; 31 4.25,0.25; 32 4.25,0.75; 33 4.25,1.25; 34 4.25,1.75; 35 4.25,2.25; 36 4.25,2.75 | smd 0.28 x 1.5: 13 -2.75,-4.25; 14 -2.25,-4.25; 15 -1.75,-4.25; 16 -1.25,-4.25; 17 -0.75,-4.25; 18 -0.25,-4.25; 19 0.25,-4.25; 20 0.75,-4.25; 21 1.25,-4.25; 22 1.75,-4.25; 23 2.25,-4.25; 24 2.75,-4.25; 37 2.75,4.25; 38 2.25,4.25; 39 1.75,4.25; 40 1.25,4.25; 41 0.75,4.25; 42 0.25,4.25; 43 -0.25,4.25; 44 -0.75,4.25; 45 -1.25,4.25; 46 -1.75,4.25; 47 -2.25,4.25; 48 -2.75,4.25
KMR2 = smd 1 x 1: 1 2,0.8; 2 2,-0.8; 3 -2,0.8; 4 -2,-0.8
1X14_NO_SILK = drill 1.016 pad 1.88: 1 0,0; 2 2.54,0; 3 5.08,0; 4 7.62,0; 5 10.16,0; 6 12.7,0; 7 15.24,0; 8 17.78,0; 9 20.32,0; 10 22.86,0; 11 25.4,0; 12 27.94,0; 13 30.48,0; 14 33.02,0
XTAL3215 = smd 1.1 x 1.9: P$1 1.2,0; P$2 -1.2,0

### Placement (x,y rotation side)
1  2.41,32.51 270 top
2  18.54,31.75 180 top
13  2.41,34.39 270 top
B1  42.93,35.81 90 top
B2  42.93,25.65 90 top
B3  42.93,15.49 90 top
B4  42.93,5.33 90 top
BUZZ  25.78,2.79 0 top
C1  10.32,19.43 90 top
C2  13.78,8.13 270 top
C3  21.34,34.04 270 top
C4  11.34,8.11 270 top
C5  25.65,36.7 0 top
C6  7,33.46 0 top
C7  18.56,9.6 270 top
C8  5.74,9.59 270 top
C14  16.12,9.6 270 top
D1  12.06,2.92 180 top
FAN  17.4,2.79 0 top
J1  3.81,38.86 0 top
J2  2.03,23.88 0 top
J3  2.67,7.11 90 top
K-TYPE  26.92,39.12 180 top
LDO  6.64,16.67 180 top
LOGO1  6.1,6.1 90 bottom
MAX31855  25.65,30.48 180 top
Q1  7.11,2.54 180 top
R2  6.99,31.11 0 top
R3  2.41,30.35 180 top
R4  37.97,24.64 90 top
R5  37.97,14.61 90 top
R6  37.85,4.45 90 top
R7  2.36,36.44 180 top
R8  17.53,35.05 180 top
R9  7.11,5.46 180 top
R11  37.85,34.8 90 top
RELAY  15.75,39.12 0 top
SAMD21  17.02,18.29 90 top
SW1  12.96,29.21 270 top
SWITCH  9.65,28.19 180 top
TFT  33.53,4.06 90 top
X2  12.68,11.2 0 top

### Tracks (layer width: path | path; a pad name or v marks a point on that pad's centre or on a via)
!RESET  (via drill 0.33, 0.41)
  Top 0.203: SW1.1 13.76,25.96 v13.59,25.79
  Top 0.254: SW1.1 SW1.3 | SAMD21.40 14.24,19.54 v14.48,19.3 | v8.13,21.34 6.1,21.34 4.32,19.56 4.32,18.92 J3.5
  Bottom 0.254: v13.59,25.79 14.48,24.9 14.48,21.34 | 14.48,21.34 v14.48,19.3 | v8.13,21.34 14.48,21.34
+3V3  (via drill 0.33, 0.41, 0.6, 0.65)
  Top 0.254: v16.76,18.8 SAMD21.6 16.77,12.7 18.03,11.43 18.03,10.56 C7.1 | SAMD21.36 14.27,21.29 v16.76,18.8 | 12.78,17.53 SAMD21.44 14.74,17.54 16,18.8 v16.76,18.8 | v16.76,18.8 17.78,18.8 19.04,17.54 SAMD21.17 30.21,17.54 v30.73,17.02 | C3.2 22.93,33.09 23.65,33.81 MAX31855.4
  Top 0.305: TFT.8 34.8,20.57 v42.93,20.57 | 21.32,33.03 C3.2
  Top 0.406: 21.34,31.75 C3.2 | LDO.5 7.63,15.37 v8.89,16.64
  Top 0.61: v18.29,26.92 21.34,29.97 21.34,31.75 | J3.2 3.55,10.54 C8.1 7.62,10.54 v8.26,11.18
  Bottom 0.305: B4.1 44.2,4.1 44.2,11.72 B3.1 44.2,14.26 44.2,19.3 v42.93,20.57 B2.1 44.2,24.42 44.2,32.04 B1.1 | TFT.8 30.73,19.05 v30.73,17.02
  Bottom 0.61: v18.29,26.92 16.76,25.4 v16.76,18.8 15.88,17.91 10.16,17.91 v8.89,16.64 8.89,11.81 v8.26,11.18
A0  (via drill 0.41, 0.65)
  Top 0.254: SAMD21.3 15.27,15.58 v15.56,15.88 | B1.2 40.93,36.32 38.61,36.32 38.03,35.75 R11.2 v37.85,37.85
  Bottom 0.254: v15.56,15.88 15.75,16 18.17,18.42 23.5,18.42 31.49,26.41 31.49,34.81 32.49,35.81 35.81,35.81 v37.85,37.85
A1  (via drill 0.41, 0.65)
  Top 0.254: SAMD21.7 17.27,15.73 v18.03,16.5 | B2.2 40.68,25.91 38.29,25.91 R4.2 37.85,25.71 v37.85,27.69
  Bottom 0.254: v37.85,27.69 35.81,25.65 32.63,25.65 24.12,17.14 18.68,17.14 v18.03,16.5
A2  (via drill 0.33, 0.65)
  Top 0.254: B3.2 40.49,15.55 R5.2 37.97,17.4 v37.85,17.53 | SAMD21.8 17.77,14.97 18.03,15.24 18.92,15.24 v19.43,15.88
  Bottom 0.254: v37.85,17.53 35.81,15.49 19.81,15.49 v19.43,15.88
A3  (via drill 0.41 pad 0.55, 0.65)
  Top 0.254: 38.04,5.59 37.85,5.78 v37.85,7.37 | B4.2 40.68,5.59 38.04,5.59 | 38.04,5.59 R6.2 | SAMD21.9 18.27,12.72 19.05,11.94 19.81,11.94 v21.34,10.41
  Bottom 0.254: v37.85,7.37 37.34,7.87 23.88,7.87 v21.34,10.41
A4
  Top 0.254: SAMD21.10 18.77,12.98 19.3,12.45 21.08,12.45 24.13,9.4 24.13,4.45 BUZZ.1
A5
  Top 0.254: SAMD21.47 11.72,16.04 9.78,14.1 9.78,10.03 6.16,6.42 R9.2
AREF
  Top 0.254: SAMD21.4 15.77,10.52 16.38,9.91 C14.1
BASE
  Top 0.254: R9.1 Q1.1
D0
  Top 0.254: SAMD21.16 28.68,17.04 31.5,14.22 TFT.5
D1
  Top 0.254: SAMD21.15 27.66,16.54 32.51,11.68 TFT.4
D3
  Top 0.254: SAMD21.14 26.63,16.04 TFT.3
D5  (via drill 0.41)
  Top 0.254: SAMD21.24 22.02,21.04 v22.84,21.86 | RELAY.2 18.29,34.86 R8.1
  Bottom 0.254: v22.84,21.86 22.84,25.67 18.29,30.23 RELAY.2
D6
  Top 0.254: SAMD21.29 17.77,25.18 16.65,26.3 16.65,32.52 11.68,37.48 11.68,38.61 J1.4
D7
  Top 0.254: SAMD21.30 17.27,24.89 16.19,25.97 16.19,32.32 11.43,37.08 10.67,37.08 J1.3
D10
  Top 0.254: SAMD21.27 18.77,24.38 19.78,25.4 21.59,25.4 22.1,24.89 24.38,24.89 25.02,25.53 MAX31855.6
D11
  Top 0.254: MAX31855.7 26.29,25.53 24.64,23.88 22.35,23.88 21.08,22.61 19.84,22.61 SAMD21.25
D12
  Top 0.254: SAMD21.28 18.27,25.13 19.56,26.42 22.76,26.42 MAX31855.5
D13  (via drill 0.41)
  Top 0.254: SAMD21.26 19.27,23.6 19.8,24.13 v20.7,24.13 | R7.1 3.42,36.08 v4.84,36.08
  Bottom 0.254: v20.7,24.13 20.7,26.29 17.02,29.97 17.02,31.75 12.69,36.08 v4.84,36.08
D+
  Top 0.203: J2.D+ 5.72,23.88 5.97,24.13 14.73,24.13 15.27,23.59 SAMD21.34
D-
  Top 0.203: J2.D- 4.77,24.51 14.86,24.51 15.77,23.6 SAMD21.33
FAN
  Top 0.305: Q1.3 8.73,1.44 D1.A 12.15,0.99 18.14,0.99 FAN.2
GND  (via drill 0.41, 0.6)
  other vias: 18.92,19.43 14.35,16.51 12.95,32.77 25.65,30.48 21.34,14.22 30.73,2.03 35.81,11.68 35.81,21.84 35.81,29.46 36.07,2.03
  pour Top: -0.51,41.66 -0.51,-1.02 39.37,-1.02 39.37,41.91 -0.25,41.91
  pour Bottom: -1.02,41.91 -1.02,-0.76 -0.76,-1.02 39.37,-0.76 39.37,41.91
MISO
  Top 0.254: TFT.9 28.68,19.54 SAMD21.21
MOSI
  Top 0.254: SAMD21.19 31.25,18.54 33.02,16.76 TFT.6
N$1
  Top 0.254: 1.A 1.46,32.16 R3.2
N$2
  Top 0.254: R7.2 1.41,34.21 13.A
N$3
  Top 0.254: 2.A 17.75,32.8 16.58,33.97 R8.2
N$5
  Top 0.254: SAMD21.1 14.27,13.76 14.22,13.72 12.7,13.72 11.48,12.5 X2.P$2 11.48,9.17 C4.1
N$7
  Top 0.254: C2.1 13.88,9.18 X2.P$1 13.88,12.07 14.77,12.95 SAMD21.2
SCK
  Top 0.254: SAMD21.20 31.23,19.04 31.5,19.3 TFT.7
SCL
  Top 0.254: SAMD21.32 16.24,22.57 16.24,24.52 15.28,25.48 15.28,31.84 11.38,35.74 6.93,35.74 J1.1
SDA
  Top 0.254: SAMD21.31 16.77,24.63 15.73,25.67 15.73,32.03 11.31,36.45 8.76,36.45 J1.2
SWCLK
  Top 0.254: SAMD21.45 11.2,17.04 7.87,13.72 3.68,13.72 J3.4
SWDIO
  Top 0.254: J3.3 3.18,12.7 7.62,12.7 11.46,16.54 SAMD21.46
T+
  Top 0.254: MAX31855.3 25.02,36.39 C5.1 24.7,38.8 K-TYPE.2
T-
  Top 0.254: MAX31855.2 26.29,36.39 C5.2 26.6,38.8 K-TYPE.1
VBUS
  Top 0.305: J2.VBUS 5.87,25.18 6.35,25.65
  Top 0.61: SWITCH.1 9.65,26.67 8.64,25.65 6.35,25.65
VBUS_SW  (via drill 0.33)
  Top 0.254: R3.1 3.48,30.61 3.61,30.73
  Top 0.406: C6.1 6.05,31.13 R2.1 6.04,30.73 | SWITCH.2 6.04,29.27 6.04,30.73 | FAN.1 17.27,2.92 D1.C | 3.61,30.73 6.04,30.73 | LDO.3 5.69,18.77 v6.6,19.68 7.59,18.7 LDO.1
  Bottom 0.61: TFT.1 33.02,4.06 32,5.08 19.05,5.08 17.4,3.43 FAN.1 13.72,2.79 6.6,9.91 v6.6,19.68 6.6,27.69 SWITCH.2
VDDCORE
  Top 0.254: C1.1 10.39,18.04 SAMD21.43

### Text on the board
tPlace: YEL+ | RED- | SCL | SDA | D7 | D6 | Reset | !RST | SWC | SWD | 3V3 | GND
bPlace: YEL+ | RED- | SCL | SDA | D7 | D6 | B1 | RELAY | K-TYPE | B2 | SWITCH | unexpectedmaker.com | MAKE SOMETHING / UNEXPECTED | B3 | B4 | FAN | BUZZ | Reflow Master / 2018-3